# Altium schematic sheet Compressor and Sidechain.SchDoc
size A4; SheetNumber: 3; SheetTotal: 7
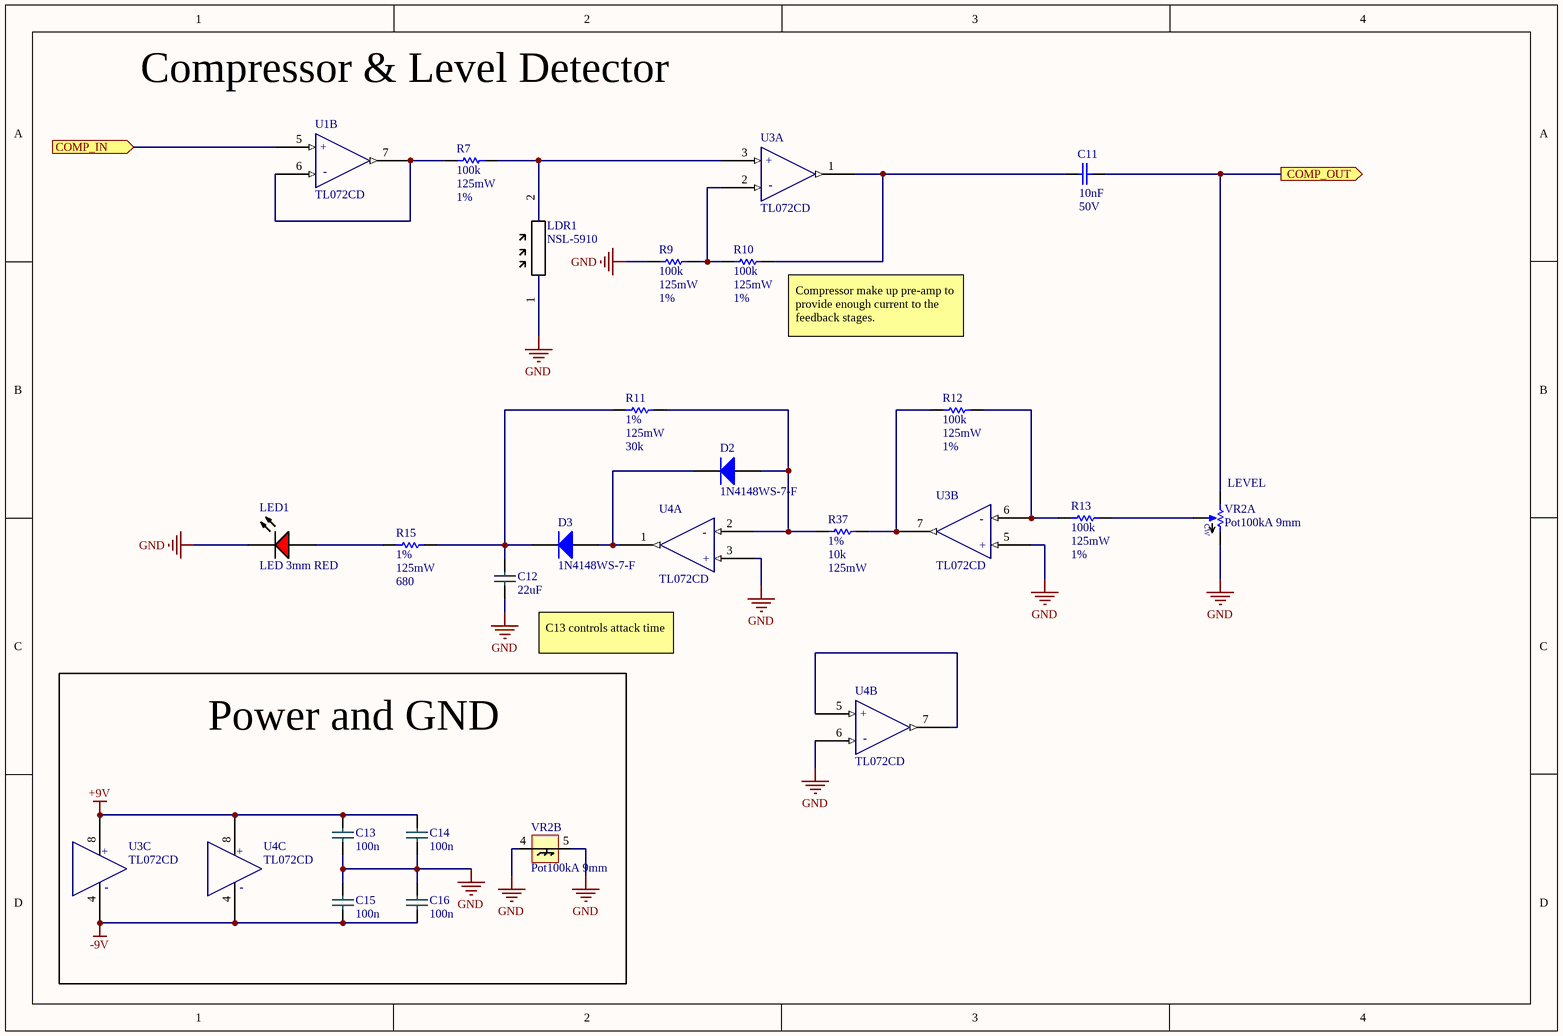
[diagram p0: Compressor and Sidechain.SchDoc]

## Parts
C11  Capacitance: 10nF  Rated Voltage: 50V  [0805-CAP]  (hidden comment: Cap 10nF 0805 C0G)
C12  value 22uF  [1206-CAP]  (hidden comment: Cap 1206 22uF)
C13  value 100n  [0805-CAP]  (hidden comment: Cap 0805 100nF 4)
C14  value 100n  [0805-CAP]  (hidden comment: Cap 0805 100nF 4)
C15  value 100n  [0805-CAP]  (hidden comment: Cap 0805 100nF 4)
C16  value 100n  [0805-CAP]  (hidden comment: Cap 0805 100nF 4)
D2  1N4148WS-7-F  [1N4148WS-7-F]
D3  1N4148WS-7-F  [1N4148WS-7-F]
LDR1  NSL-5910  [FB_28C0236-0JW-10]
LED1  LED 3mm RED  [KING-WP710A10QBCD_V]
R7  Resistance: 100k  Power: 125mW  Tolerance (+-): 1%  [0805-RES]  (hidden comment: Res 100k 1% 0805)
R9  Resistance: 100k  Power: 125mW  Tolerance (+-): 1%  [0805-RES]  (hidden comment: Res 100k 1% 0805)
R10  Resistance: 100k  Power: 125mW  Tolerance (+-): 1%  [0805-RES]  (hidden comment: Res 100k 1% 0805)
R11  Tolerance (+-): 1%  Power: 125mW  Resistance: 30k  [0805-RES]  (hidden comment: Res 30k 1% 0805)
R12  Resistance: 100k  Power: 125mW  Tolerance (+-): 1%  [0805-RES]  (hidden comment: Res 100k 1% 0805)
R13  Resistance: 100k  Power: 125mW  Tolerance (+-): 1%  [0805-RES]  (hidden comment: Res 100k 1% 0805)
R15  Tolerance (+-): 1%  Power: 125mW  Resistance: 680  [0805-RES]  (hidden comment: Res 680R 1% 0805)
R37  Tolerance (+-): 1%  Resistance: 10k  Power: 125mW  [0805-RES]  (hidden comment: Res 10k 1% 0805)
U1  TL072CD  [SOIC8-127P600X175-8N]  (part B of 3)
U3  TL072CD  [SOIC8-127P600X175-8N]  (parts A,B,C of 3)
U4  TL072CD  [SOIC8-127P600X175-8N]  (parts A,B,C of 3)
VR2  Pot100kA 9mm  [LJV 9mm pot]  (parts A,B of 2)

## Blocks framed on the sheet
Power and GND: C13-C16 U3 U4 VR2

## Ports
COMP_IN (in), COMP_OUT (out)

## Nets
+9V: C13.2 C14.2 U3.8(V+) U4.8(V+)
-9V: C15.1 C16.1 U3.4(V-) U4.4(V-)
GND: C12.1 C13.1 C14.1 C15.2 C16.2 LDR1.1 LED1.2(K) R9.2 U3.5(IN+) U4.3(IN+) U4.6(IN-) VR2.3(CWPIN) VR2.4 VR2.5
COMP_IN: U1.5(IN+) ; port COMP_IN
COMP_OUT: C11.2 VR2.1(CCWPIN) ; port COMP_OUT
NetC11_1: C11.1 R10.1 U3.1(OUT)
NetC12_2: C12.2 D3.2(K) R11.1 R15.2
NetD2_1: D2.1(A) R11.2 R37.1 U4.2(IN-)
NetD2_2: D2.2(K) D3.1(A) U4.1(OUT)
NetLDR1_2: LDR1.2 R7.1 U3.3(IN+)
NetLED1_1: LED1.1(A) R15.1
NetR7_2: R7.2 U1.6(IN-) U1.7
NetR9_1: R9.1 R10.2 U3.2(IN-)
NetR12_1: R12.1 R13.2 U3.6(IN-)
NetR12_2: R12.2 R37.2 U3.7
NetR13_1: R13.1 VR2.2(WIPER)
NetU4_5: U4.5(IN+) U4.7

## Notes on the sheet
- Compressor & Level Detector
- (near R10) Compressor make up pre-amp to provide enough current to the feedback stages.
- (near VR2) LEVEL
- C13 controls attack time
- (in symbol CMP-028-0012-7, part A) +; -
- (in symbol CMP-028-0012-7, part B) +; -
- (in symbol CMP-028-0012-7, part C) +; -
- (in symbol CMP-028-0051-3, part A) CW

## Library data of the parts
C11 = CMP-04096-2: Cap 10nF 0805 C0G 50V +-5%; Tolerance (+-): 5%; Dielectric: C0G; Maximum operating temperature: 125°C; Height: 950µm; Size (Imperial): 0805
C12 = CMP-019-0043-11: 22uF, 25V, X5R, 20%; Source: main.SchLib; Mount: Surface Mount; Tolerance: 20%; Case/Package: 1206; Min Operating Temperature: -55°C; Voltage Rating: 25V; Length: 0.126inch; Voltage Rating (DC): 25V; Thickness: 0.02inch; Dielectric: X5R; Stock 1: 409; Packaging: Tape and Reel; Capacitance: 22uF; Case Code (Metric): 3216; RoHS: Yes; Width: 0.063inch; Max Operating Temperature: 85°C; Case Code (Imperial): 1206; Pricing 1: 1 = 0.72000, 10 = 0.51900, 50 = 0.51900, 100 = 0.34200, 1000 = 0.21500, 10000 = 0.15900 (USD); Design Item ID: Cap 1206 22uF
C13-C16 = CMP-019-0144-11: 0.1uF 25volts C0G 5%; Source: main.SchLib; PackageDescription: Chip Capacitor; LatestRevisionNote: IPC-7351 Footprint Added.; LatestRevisionDate: 29-May-2009; Publisher: Altium Limited; Published: 8-Jun-2000; Mouser part: 81-GRM31C5C1E104JA01; Design Item ID: Cap 0805 100nF 4; PackageReference: C1206; Fitted: Fitted
D2 D3 = CMP-029-0008-5: Fast Switching Diode, 75 V, 0.3 A, -65 to 150 degC, 2-Pin SOD323, RoHS, Tape and Reel; Manufacturer: Pericom; Forward Current: 300mA; Power Rating: 200mW; Current: 2A; Forward Voltage: 1.25V; Peak Reverse Current: 1uA; Voltage Rating (DC): 75V; Recovery Time: 4ns; Current Rating: 150mA; Element Configuration: Single; Capacitance: 2pF; Polarity: Standard; Available Preview Images: 2D; Pricing 1: 1 = 0.19000, 10 = 0.17100, 100 = 0.09320, 500 = 0.05736, 1000 = 0.03911 (USD); Width: 1.4mm; Design Item ID: 1N4148WS-7-F; ComponentLink8URL: https://datasheet.ciiva.com/911/ds30097-911742.pdf?src-supplier=Digi-Key; ComponentLink19Description: http://datasheet.octopart.com/1N4148WS-7-F-Diodes-Inc.-datasheet-14053694.pdf?src-supplier=IIIC; ComponentLink20Description: http://datasheet.octopart.com/1N4148WS-7-F-Multicomp-datasheet-21397732.pdf?src-supplier=Newark; PackageDescription: 2-Pin Small Outline Diode, Body 1.7 x 1.3 mm; Packaging: Tape and Reel; ComponentLink3URL: https://datasheet.ciiva.com/16199/ds30097-16199061.pdf?src-supplier=Future+Electronics; ComponentLink20URL: http://datasheet.octopart.com/1N4148WS-7-F-Multicomp-datasheet-21397732.pdf?src-supplier=Newark; ComponentLink16URL: http://datasheet.octopart.com/1N4148WS-7-F-Diodes-Inc.-datasheet-479.pdf?src-supplier=Mouser; ComponentLink1Description: Manufacturer URL; ComponentLink10URL: https://datasheet.ciiva.com/911/ds30097-911743.pdf?src-supplier=Digi-Key; Source: main.SchLib; ComponentLink6Description: https://datasheet.ciiva.com/8300/ds30097-8300396.pdf?src-supplier=Avnet; Lead Free: Lead Free; ComponentLink5URL: https://datasheet.ciiva.com/1179/ds30097-1179355.pdf?src-supplier=Element14; ComponentLink11Description: http://datasheet.octopart.com/1N4148WS-7-F-Diodes-Inc.-datasheet-11839050.pdf?src-supplier=Newark; ComponentLink4URL: https://datasheet.ciiva.com/16472/ds30097-16472599.pdf?src-supplier=Avnet+Asia; ComponentLink13URL: http://datasheet.octopart.com/1N4148WS-7-F-Diodes-Inc.-datasheet-10031541.pdf?src-supplier=Newark; ComponentLink2Description: Datasheet; ComponentLink4Description: https://datasheet.ciiva.com/16472/ds30097-16472599.pdf?src-supplier=Avnet+Asia; PackageReference: SOD323-2; ComponentLink3Description: https://datasheet.ciiva.com/16199/ds30097-16199061.pdf?src-supplier=Future+Electronics; Mount: Surface Mount; Manufacturer Part Number: 1N4148WS-7-F; ComponentLink12Description: http://datasheet.octopart.com/1N4148WS-7-F-Diodes-Inc.-datasheet-8329243.pdf?src-supplier=Newark; ComponentLink9Description: https://datasheet.ciiva.com/25946/ds30097-25946926.pdf?src-supplier=Avnet+Europe; ComponentLink8Description: https://datasheet.ciiva.com/911/ds30097-911742.pdf?src-supplier=Digi-Key; ComponentLink15Description: http://datasheet.octopart.com/1N4148WS-7-F-Diodes-Inc.-datasheet-62305040.pdf?src-supplier=Element14; Power Dissipation: 200mW; ComponentLink13Description: http://datasheet.octopart.com/1N4148WS-7-F-Diodes-Inc.-datasheet-10031541.pdf?src-supplier=Newark; REACH SVHC: No SVHC; ComponentLink21URL: http://datasheet.octopart.com/1N4148WS-7-F-Pericom-datasheet-62305040.pdf?src-supplier=Newark; ComponentLink12URL: http://datasheet.octopart.com/1N4148WS-7-F-Diodes-Inc.-datasheet-8329243.pdf?src-supplier=Newark; Radiation Hardening: No; ComponentLink18URL: http://datasheet.octopart.com/1N4148WS-7-F-Diodes-Inc.-datasheet-7284054.pdf?src-supplier=Jameco; Height: 1mm; Max Forward Surge Current (Ifsm): 2A; ComponentLink1URL: http://www.diodes.com/; ComponentLink6URL: https://datasheet.ciiva.com/8300/ds30097-8300396.pdf?src-supplier=Avnet; ComponentLink10Description: https://datasheet.ciiva.com/911/ds30097-911743.pdf?src-supplier=Digi-Key; ComponentLink7URL: https://datasheet.ciiva.com/911/ds30097-911741.pdf?src-supplier=Digi-Key; Length: 1.8mm; Stock 1: 107341; ComponentLink18Description: http://datasheet.octopart.com/1N4148WS-7-F-Diodes-Inc.-datasheet-7284054.pdf?src-supplier=Jameco; ComponentLink17Description: http://datasheet.octopart.com/1N4148WS-7-F-Diodes-Inc.-datasheet-139480.pdf?src-supplier=Digi-Key; Max Repetitive Reverse Voltage (Vrrm): 75V; Max Reverse Voltage (DC): 75V; ComponentLink5Description: https://datasheet.ciiva.com/1179/ds30097-1179355.pdf?src-supplier=Element14; Package Quantity: 3000; Contact Plating: Tin; ComponentLink14Description: http://datasheet.octopart.com/1N4148WS-7-F-Diodes-Inc.-datasheet-34441419.pdf?src-supplier=Allied+Electronics; ComponentLink11URL: http://datasheet.octopart.com/1N4148WS-7-F-Diodes-Inc.-datasheet-11839050.pdf?src-supplier=Newark; ComponentLink7Description: https://datasheet.ciiva.com/911/ds30097-911741.pdf?src-supplier=Digi-Key; Voltage: 75V; DatasheetVersion: Rev. 25-2, 03/2016; ComponentLink17URL: http://datasheet.octopart.com/1N4148WS-7-F-Diodes-Inc.-datasheet-139480.pdf?src-supplier=Digi-Key; ComponentLink16Description: http://datasheet.octopart.com/1N4148WS-7-F-Diodes-Inc.-datasheet-479.pdf?src-supplier=Mouser; ComponentLink19URL: http://datasheet.octopart.com/1N4148WS-7-F-Diodes-Inc.-datasheet-14053694.pdf?src-supplier=IIIC; Reverse Recovery Time: 4ns; Peak Non-Repetitive Surge Current: 2A; Number of Pins: 2; ComponentLink15URL: http://datasheet.octopart.com/1N4148WS-7-F-Diodes-Inc.-datasheet-62305040.pdf?src-supplier=Element14; Average Rectified Current: 150mA; Weight: 0.000173oz; Max Surge Current: 2A; Max Operating Temperature: 150°C; Min Operating Temperature: -65°C; Output Current: 150mA; ComponentLink21Description: http://datasheet.octopart.com/1N4148WS-7-F-Pericom-datasheet-62305040.pdf?src-supplier=Newark; ComponentLink2URL: http://www.diodes.com/datasheets/ds30097.pdf; ComponentLink9URL: https://datasheet.ciiva.com/25946/ds30097-25946926.pdf?src-supplier=Avnet+Europe; ComponentLink14URL: http://datasheet.octopart.com/1N4148WS-7-F-Diodes-Inc.-datasheet-34441419.pdf?src-supplier=Allied+Electronics
LDR1 = NSL-5910: Ambient Light Sensors Hermetic Photocell
LED1 = CMP-036-0000-2: THT LED round mono-color waterclear, WL-TMRW , RED; PartNumber: 151034rs03000; Manufacturer: Wuerth Elektronik; Darkglass part: D00-0042; Available Preview Images: 2D; Selective Soldering: YES; ComponentLink2URL: http://katalog.we-online.de/pbs/datasheet/7448042001.pdfhttp://katalog.we-online.de/pbs/datasheet/7448042001.pdfhttp://katalog.we-online.de/pbs/datasheet/7448042001.pdfhttp://katalog.we-online.de/pbs/datasheet/151033BS03000.pdf; Fitted: Fitted; Emitting color: RED; ComponentLink1URL: http://www.we-online.com; Design Item ID: LED 3mm RED; Supplied by Darkglass: YES; Source: main.SchLib; ComponentLink1Description: Manufacturer URL; Mouser part: 710-151034RS03000; PackageReference: Type 3mm; ComponentLink2Description: Datasheet; Darkglass: D00-0042
R7 R9 R10 R12 R13 = CMP-02701-2: Resistor 100k +-1% 0805 Thin film 0.125W +-50ppm/°C; Temperature Coefficient (ppm/°C): 50; Maximum working voltage: 150V; Composition: Thin film; Size (Imperial): 0805
R11 = CMP-02638-2: Resistor 30k +-1% 0805 Thin film 0.125W +-50ppm/°C; Maximum working voltage: 150V; Temperature Coefficient (ppm/°C): 50; Composition: Thin film; Size (Imperial): 0805
R15 = CMP-02452-2: Resistor 680R +-1% 0805 Thin film 0.125W +-50ppm/°C; Temperature Coefficient (ppm/°C): 50; Maximum working voltage: 150V; Size (Imperial): 0805; Composition: Thin film
R37 = CMP-02586-2: Resistor 10k +-1% 0805 Thin film 0.125W +-50ppm/°C; Maximum working voltage: 150V; Temperature Coefficient (ppm/°C): 50; Size (Imperial): 0805; Composition: Thin film
U1 U3 U4 = CMP-028-0012-7: Operational Amplifiers - Op Amps Dual Low Noise JFET SOIC8; Manufacturer 1: Texas Instruments; Operating Supply Voltage: 18V; Number of Elements: 2; Bandwidth: 3MHz; Dual Supply Voltage: 9V; Input Bias Current: 200pA; Min Dual Supply Voltage: 3.5V; Voltage Gain: 106.02dB; Max I/O Voltage: 10mV; Common Mode Rejection Ratio: 70dB; Input Offset Voltage (Vos): 3mV; Slew Rate: 13V/µs; Operating Supply Current: 1.4mA; Nominal Supply Current: 5mA; ComponentLink4URL: http://www.farnell.com/datasheets/1862384.pdf?src-supplier=Element14; ComponentLink4Description: http://www.farnell.com/datasheets/1862384.pdf?src-supplier=Element14; Manufacturer Part Number 1: TL072CD; REACH SVHC: No SVHC; Pricing 1: 1 = 0.71000, 10 = 0.59500, 50 = 0.59500, 100 = 0.38400, 1000 = 0.30700, 10000 = 0.25000 (USD); RoHS: Yes; Source: main.SchLib; ComponentLink1URL: http://www.ti.com/general/docs/lit/getliterature.tsp?genericPartNumber=TL072&&fileType=pdf&src-supplier=Avnet; Height: 1.58mm; Gain Bandwidth Product: 3MHz; ComponentLink5URL: http://focus.ti.com/lit/ds/symlink/tl074.pdf?src-supplier=Avnet+Asia; Number of Amplifiers: 2; ComponentLink2Description: https://www.distrelec.biz/Web/Downloads/_t/ds/tl07x-series_eng_tds.pdf?mime=application%2Fpdf&src-supplier=Distrelec; Radiation Hardening: No; ComponentLink3URL: http://www.ti.com/lit/ds/symlink/tl071a.pdf?src-supplier=Digi-Key; Unity Gain Bandwidth Product: 3MHz; Case/Package: D; Max Operating Temperature: 85°C; Packaging: Rail/Tube; Number of Circuits: 2; Number of Pins: 8; Length: 4.9mm; Number of Channels: 2; Package Quantity: 75; Min Operating Temperature: -40°C; Width: 3.91mm; Lead Free: Lead Free; Stock 1: 14514; ComponentLink3Description: http://www.ti.com/lit/ds/symlink/tl071a.pdf?src-supplier=Digi-Key; Nominal Gain Bandwidth Product: 3MHz; ComponentLink5Description: http://focus.ti.com/lit/ds/symlink/tl074.pdf?src-supplier=Avnet+Asia; Max Dual Supply Voltage: 18V; ComponentLink1Description: http://www.ti.com/general/docs/lit/getliterature.tsp?genericPartNumber=TL072&&fileType=pdf&src-supplier=Avnet; ComponentLink2URL: https://www.distrelec.biz/Web/Downloads/_t/ds/tl07x-series_eng_tds.pdf?mime=application%2Fpdf&src-supplier=Distrelec; Design Item ID: TL072CD
VR2 = CMP-028-0051-3: LJV 9mm pot; Darkglass part: D00-0000; Manufacturer Part Number: RP09110NOBA-H02-1484 (A104,KA15A6.5); Value: 100kA; Selective Soldering: YES; SET POSITION: 1; Design Item ID: Pot100kA 9mm; Source: main.SchLib; Supplied by Darkglass: YES; PartId: 1